# Altium schematic sheet RS485.SchDoc
size A4
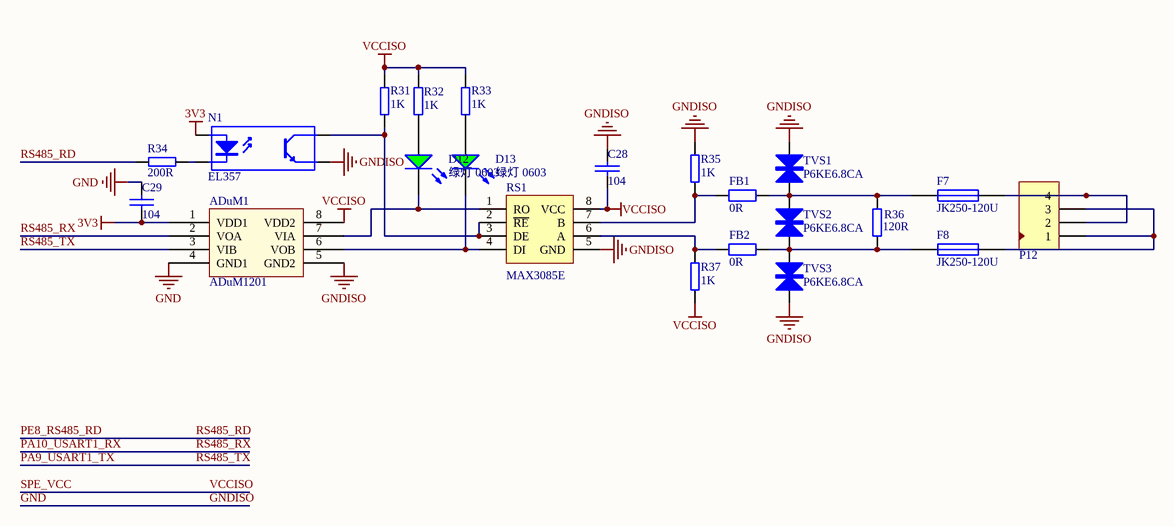
[diagram p0: RS485.SchDoc]

## Parts
ADuM1  ADuM1201  [SOIC-8]
C28  104  [LC-0603_C]
C29  104  [LC-0603_C]
D12  绿灯 0603  [LC-0603_LED_S1]
D13  绿灯 0603  [LC-0603_LED_S1]
F7  JK250-120U  [ntc250v]
F8  JK250-120U  [ntc250v]
FB1  0R  [LC-0603_L]
FB2  0R  [LC-0603_L]
N1  EL357  [lc-sop-4_P2.54]
P12  Header 4  [5.08-4P]  (value not drawn)
R31  1K  [LC-0603_R]
R32  1K  [LC-0603_R]
R33  1K  [LC-0603_R]
R34  200R  [LC-0603_R]
R35  1K  [LC-0603_R]
R36  120R  [LC-0603_R]
R37  1K  [LC-0603_R]
RS1  MAX3085E  [SOIC-8]
TVS1  P6KE6.8CA  [TVS]
TVS2  P6KE6.8CA  [TVS]
TVS3  P6KE6.8CA  [TVS]

## Nets
3V3: ADuM1.1(VDD1) C29.2 N1.1(A)
GND: ADuM1.4(GND1) ADuM1.5(GND2) C28.1 C29.1 N1.3(E) R35.1 RS1.5(GND) TVS1.2 TVS3.1  [also labelled GNDISO]
SPE_VCC: ADuM1.8(VDD2) C28.2 R31.1 R32.2 R33.1 R37.2 RS1.8(VCC)  [also labelled VCCISO]
PA9_USART1_TX: ADuM1.3(VIB)  [also labelled RS485_TX]
PA10_USART1_RX: ADuM1.2(VOA)  [also labelled RS485_RX]
PE8_RS485_RD: R34.1  [also labelled RS485_RD]
NetADuM1_6: ADuM1.6(VOB) D13.K RS1.4(DI)
NetADuM1_7: ADuM1.7(VIA) D12.K RS1.1(RO)
NetD12_A: D12.A R32.1
NetD13_A: D13.A R33.2
NetF7_1: F7.1 FB1.1 R36.2 TVS1.1 TVS2.2
NetF7_2: F7.2 P12.2 P12.4
NetF8_1: F8.1 FB2.1 R36.1 TVS2.1 TVS3.2
NetF8_2: F8.2 P12.1 P12.3
NetFB1_2: FB1.2 R35.2 RS1.7(B)
NetFB2_2: FB2.2 R37.1 RS1.6(A)
NetN1_2: N1.2(K) R34.2
NetN1_4: N1.4(C) R31.2 RS1.2(~{RE}) RS1.3(DE)

## Library data of the parts
C28 C29 = CAP
D12 D13 = 0603 绿灯: 发光二极管; ComponentLink1Description: 供应商链接; ComponentLink1URL: http://www.szlcsc.com/product/details_73152.html; Package: 0603; Supplier: LC; SuppliersPartNumber: C72043
F7 F8 = Fus: 保险丝; Value: 1A
FB1 FB2 = Res2: Resistor; Published: 8-Jun-2000; LatestRevisionDate: 17-Jul-2002; LatestRevisionNote: Re-released for DXP Platform.; PackageReference: AXIAL-0.4; Publisher: Altium Limited; Value: 0R
N1 = ST188: 反射式光电传感器; Published: 24-Mar-1999; LatestRevisionDate: 04-Mar-2005; LatestRevisionNote: Sch pins 3 & 4 Swapped.; DatasheetDocument: Nov-2003; PackageReference: DIP-4; Publisher: Altium Limited
P12 = Header 4: 接插件; LatestRevisionDate: 17-Jul-2002; LatestRevisionNote: Re-released for DXP Platform.; Publisher: Altium Limited
R31-R34 = RES2
R35-R37 = RES
TVS1-TVS3 = TVS